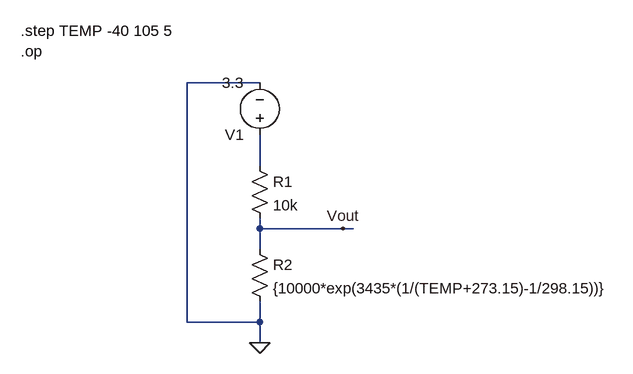
[diagram p0: schematic Draft1.asc]
Draft1.asc, the LTspice schematic file:
Version 4.1
SHEET 1 880 680
WIRE 64 48 -48 48
WIRE 64 176 64 128
WIRE 64 272 64 256
WIRE 192 272 64 272
WIRE 208 272 192 272
WIRE 64 304 64 272
WIRE -48 416 -48 48
WIRE 64 416 64 384
WIRE 64 416 -48 416
WIRE 64 448 64 416
FLAG 64 448 0
FLAG 192 272 Vout
SYMBOL voltage 64 144 R180
WINDOW 123 0 0 Left 0
WINDOW 39 0 0 Left 0
SYMATTR InstName V1
SYMATTR Value 3.3
SYMBOL res 48 160 R0
SYMATTR InstName R1
SYMATTR Value 10k
SYMBOL res 48 288 R0
SYMATTR InstName R2
SYMATTR Value {10000*exp(3435*(1/(TEMP+273.15)-1/298.15))}
TEXT -304 -32 Left 2 !.step TEMP -40 105 5\n.op

The netlist it stands for:
* Draft1.asc
V1 N001 0 3.3
R1 N001 Vout 10k
R2 Vout 0 {10000*exp(3435*(1/(TEMP+273.15)-1/298.15))}
.step TEMP -40 105 5
.op
.backanno
.end

* Results of the author's LTspice run, read from the files saved beside the schematic
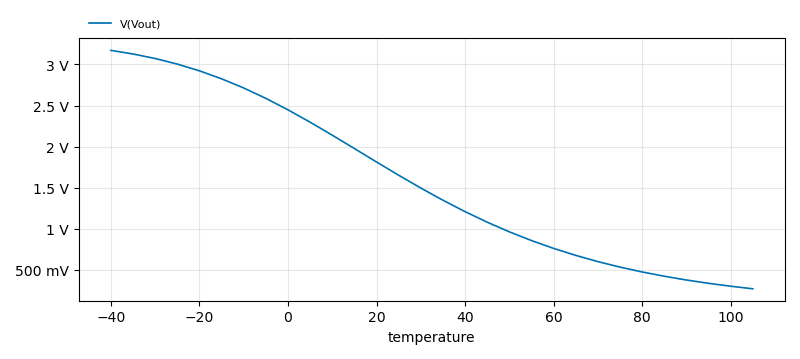
[diagram p1: Operating Point of Draft1.asc, plotted from the saved traces]
* Operating Point, 1 run:
*   V(Vout): 3.172 V at temperature=-40 , 265.2 mV at temperature=105 , min 265.2 mV, max 3.172 V